# Altium schematic sheet 1-Controller.SchDoc
size A4
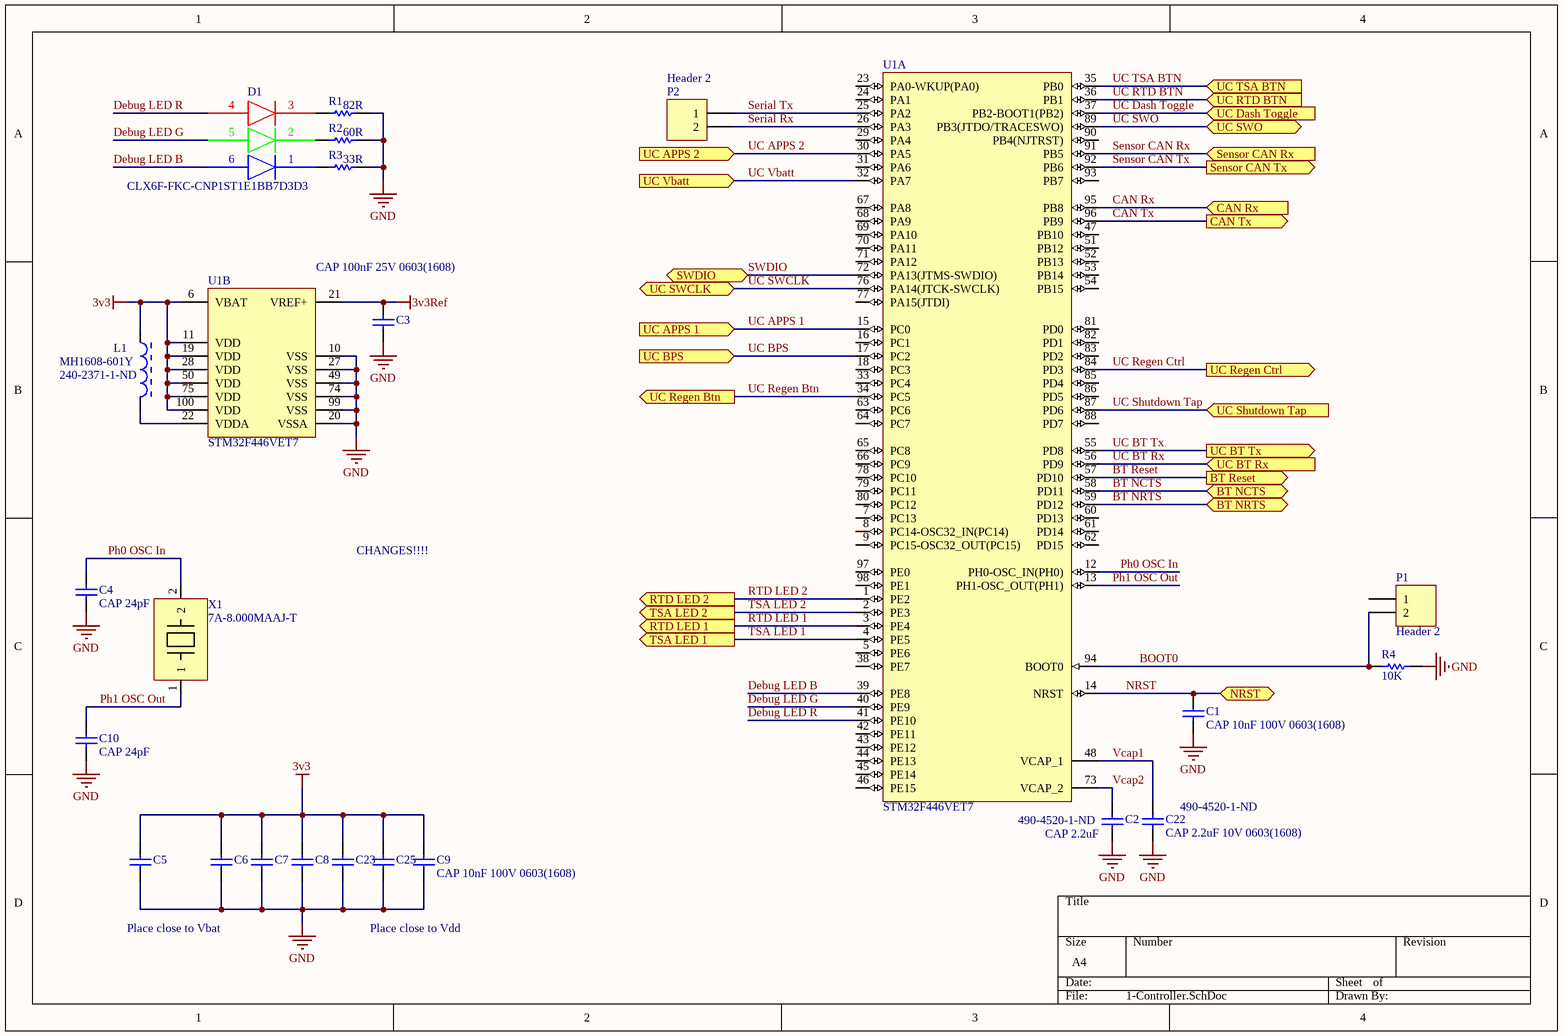
[diagram p0: 1-Controller.SchDoc]

## Parts
C1  CAP 10nF 100V 0603(1608)  [CAPC0603(1608)100_M]
C2  CAP 2.2uF  Supplier Part Number 1: 490-4520-1-ND  [CAPC0603(1608)55_N]
C3  CAP 100nF 25V 0603(1608)  [CAPC0603(1608)100_N]
C4  CAP 24pF  [CAPC0603(1608)100_N]
C5  CAP 10nF 100V 0603(1608)  [CAPC0603(1608)100_M]  (value not drawn)
C6  CAP 10nF 100V 0603(1608)  [CAPC0603(1608)100_M]  (value not drawn)
C7  CAP 10nF 100V 0603(1608)  [CAPC0603(1608)100_M]  (value not drawn)
C8  CAP 10nF 100V 0603(1608)  [CAPC0603(1608)100_M]  (value not drawn)
C9  CAP 10nF 100V 0603(1608)  [CAPC0603(1608)100_M]
C10  CAP 24pF  [CAPC0603(1608)100_N]
C22  CAP 2.2uF 10V 0603(1608)  Supplier Part Number 1: 490-4520-1-ND  [CAPC0603(1608)55_N]
C23  CAP 10nF 100V 0603(1608)  [CAPC0603(1608)100_M]  (value not drawn)
C25  CAP 10nF 100V 0603(1608)  [CAPC0603(1608)100_M]  (value not drawn)
D1  CLX6F-FKC-CNP1ST1E1BB7D3D3  [CLX6C-FKB]
L1  MH1608-601Y  Supplier Part Number 1: 240-2371-1-ND  [BOUR-MH1608_V]
P1  Header 2  [HDR1X2]
P2  Header 2  [HDR1X2]
R1  82R  [RESC0603(1608)_N]
R2  60R  [RESC0603(1608)_N]
R3  33R  [RESC0603(1608)_N]
R4  10K  [RESC0603(1608)_N]
U1  STM32F446VET7  [STM-LQFP100_L]  (parts A,B of 2)
X1  7A-8.000MAAJ-T  [2-SMD, No Lead]

## Ports
BT NCTS (bidir), BT NRTS (bidir), BT Reset (out), CAN Rx (in), CAN Tx (out), NRST (bidir), RTD LED 1 (out), RTD LED 2 (out), Sensor CAN Rx (in), Sensor CAN Tx (out), SWDIO (bidir), TSA LED 1 (out), TSA LED 2 (out), UC APPS 1 (in), UC APPS 2 (in), UC BPS (in), UC BT Rx (in), UC BT Tx (out), UC Dash Toggle (in), UC Regen Btn (out), UC Regen Ctrl (out), UC RTD BTN (in), UC Shutdown Tap (in), UC SWCLK (bidir), UC SWO (bidir), UC TSA BTN (in), UC Vbatt (in)

## Nets
3v3: C5.2 C6.2 C7.2 C8.2 C9.2 C23.2 C25.2 L1.1 U1.6(VBAT) U1.11(VDD) U1.19(VDD) U1.28(VDD) U1.50(VDD) U1.75(VDD) U1.100(VDD)
3v3Ref: C3.2 U1.21(VREF+)
GND: C1.1 C2.1 C3.1 C4.1 C5.1 C6.1 C7.1 C8.1 C9.1 C10.1 C22.1 C23.1 C25.1 R1.2 R2.2 R3.2 R4.2 U1.10(VSS) U1.20(VSSA) U1.27(VSS) U1.49(VSS) U1.74(VSS) U1.99(VSS)
BOOT0: P1.2 R4.1 U1.94(BOOT0)
BT NCTS: U1.58(PD11) ; port BT NCTS
BT NRTS: U1.59(PD12) ; port BT NRTS
BT Reset: U1.57(PD10) ; port BT Reset
CAN Rx: U1.95(PB8) ; port CAN Rx
CAN Tx: U1.96(PB9) ; port CAN Tx
Debug LED B: D1.6(B) U1.39(PE8)
Debug LED G: D1.5(G) U1.40(PE9)
Debug LED R: D1.4(R) U1.41(PE10)
NRST: C1.2 U1.14(NRST) ; port NRST
Ph0 OSC In: C4.2 U1.12(PH0-OSC_IN(PH0)) X1.2
Ph1 OSC Out: C10.2 U1.13(PH1-OSC_OUT(PH1)) X1.1
RTD LED 1: U1.3(PE4) ; port RTD LED 1
RTD LED 2: U1.1(PE2) ; port RTD LED 2
Sensor CAN Rx: U1.91(PB5) ; port Sensor CAN Rx
Sensor CAN Tx: U1.92(PB6) ; port Sensor CAN Tx
Serial Rx: P2.2 U1.26(PA3)
Serial Tx: P2.1 U1.25(PA2)
SWDIO: U1.72(PA13(JTMS-SWDIO)) ; port SWDIO
TSA LED 1: U1.4(PE5) ; port TSA LED 1
TSA LED 2: U1.2(PE3) ; port TSA LED 2
UC APPS 1: U1.15(PC0) ; port UC APPS 1
UC APPS 2: U1.30(PA5) ; port UC APPS 2
UC BPS: U1.17(PC2) ; port UC BPS
UC BT Rx: U1.56(PD9) ; port UC BT Rx
UC BT Tx: U1.55(PD8) ; port UC BT Tx
UC Dash Toggle: U1.37(PB2-BOOT1(PB2)) ; port UC Dash Toggle
UC Regen Btn: U1.34(PC5) ; port UC Regen Btn
UC Regen Ctrl: U1.84(PD3) ; port UC Regen Ctrl
UC RTD BTN: U1.36(PB1) ; port UC RTD BTN
UC Shutdown Tap: U1.87(PD6) ; port UC Shutdown Tap
UC SWCLK: U1.76(PA14(JTCK-SWCLK)) ; port UC SWCLK
UC SWO: U1.89(PB3(JTDO/TRACESWO)) ; port UC SWO
UC TSA BTN: U1.35(PB0) ; port UC TSA BTN
UC Vbatt: U1.32(PA7) ; port UC Vbatt
Vcap1: C22.2 U1.48(VCAP_1)
Vcap2: C2.2 U1.73(VCAP_2)
NetD1_1: D1.1(B) R3.1
NetD1_2: D1.2(G) R2.1
NetD1_3: D1.3(R) R1.1
NetL1_2: L1.2 U1.22(VDDA)

Not connected (* = marked no-connect by the designer): P1 1; U1 5(PE6) 7(PC13) 8(PC14-OSC32_IN(PC14)) 9(PC15-OSC32_OUT(PC15)) 16(PC1) 18(PC3) 23(PA0-WKUP(PA0)) 24(PA1) 29(PA4) 31(PA6) 33(PC4) 38(PE7) 42(PE11) 43(PE12) 44(PE13) 45(PE14) 46(PE15) 47(PB10) 51(PB12) 52(PB13) 53(PB14) 54(PB15) 60(PD13) 61(PD14) 62(PD15) 63(PC6) 64(PC7) 65(PC8) 66(PC9) 67(PA8) 68(PA9) 69(PA10) 70(PA11) 71(PA12) 77(PA15(JTDI)) 78(PC10) 79(PC11) 80(PC12) 81(PD0) 82(PD1) 83(PD2) 85(PD4) 86(PD5) 88(PD7) 90(PB4(NJTRST)) 93(PB7) 97(PE0) 98(PE1)

## Notes on the sheet
- CHANGES!!!!
- Place close to Vbat
- Place close to Vdd

## Library data of the parts
C1 C5-C9 C23 C25 = CMP-1035-02326-1: CAP 10nF 100V ±20% 0603 (1608 Metric) Thickness 1mm SMD; Case-EIA: 0603; Tolerance: Â±20%; Case-Metric: 1608; Max Thickness: 1 mm; Technology: SMT; Value: 10nF; Rated Voltage: 100 V
C2 C22 = CMP-1035-02757-1: CAP 2.2uF 10V ±10% 0603 (1608 Metric) Thickness 0.55mm SMD; Case-EIA: 0603; Case-Metric: 1608; Tolerance: Â±10%; Value: 2.2uF; Rated Voltage: 10 V; Technology: SMT; Max Thickness: 0.55 mm; Supplier 1: Digi-Key
C3 = CMP-1035-02589-1: CAP 100nF 25V ±20% 0603 (1608 Metric) Thickness 1mm SMD; Case-EIA: 0603; Tolerance: Â±20%; Case-Metric: 1608; Value: 100nF; Max Thickness: 1 mm; Technology: SMT; Rated Voltage: 25 V
C4 C10 = CMP-1035-00843-1: CAP 24pF 16V ±2% 0603 (1608 Metric) Thickness 1mm SMD; Tolerance: Â±2%; Case-Metric: 1608; Case-EIA: 0603; Value: 24pF; Technology: SMT; Rated Voltage: 16 V; Max Thickness: 1 mm
D1 = LED - CLX6F-FKC-CNP1ST1E1BB7D3D3: Red, Green, Blue (RGB) 622nm Red, 530nm Green, 470nm Blue LED Indication - Discrete 2.1V Red, 2.7V Green, 3V Blue 6-SMD, J-Lead; ComponentLink1Description: Digikey; ComponentLink1URL: https://www.digikey.ca/product-detail/en/cree-inc/CLX6F-FKC-CNP1ST1E1BB7D3D3/CLX6F-FKC-CNP1ST1E1BB7D3D3CT-ND/6362814
L1 = CMP-2000-06698-1: Chip Bead, 600 Ohm, 1 A, -55 to 125 degC, 2-Pin SMD (0603), RoHS, Tape and Reel; Manufacturer: Bourns; Impedance @ Frequency: 600Ohm@100MHz; Online Catalog: MHSeries; DC Resistance (DCR) (Max): 200mOhm; Current Rating (Max): 1A; Other Names: MH1608-601YCT; EDA / CAD Models: DownloadfromAcceleratedDesigns; Filter Type: Power,SignalLine; Number of Lines: 1; Mounting Type: SurfaceMount; Manufacturer URL: http://www.bourns.com/; Package Description: 2-Pin Surface Mount Device, Body 1.6 x 0.8 mm; Category: Filters; Packaging: CutTape(CT); Family: FerriteBeadsandChips; Datasheet Version: 03/2015; Standard Package: 1; Mounting Technology: SurfaceMount; Package / Case: 0603(1608Metric); Datasheet URL: http://www.bourns.com/docs/Product-Datasheets/mh.pdf; Operating Temperature: -55°C~125°C; RoHS Information: MH1608SeriesMaterialDeclaration; Ratings: -; Package Reference: 0603; Series: MH; Supplier 1: Digi-Key
P1 P2 = Header 2: Header, 2-Pin; LatestRevisionDate: 17-Jul-2002; LatestRevisionNote: Re-released for DXP Platform.; Publisher: Altium Limited
R1 = CMP-1012-00048-1: 82R 0.1W 5% 0603 (1608 Metric)  SMD; Case-Metric: 1608; Value: 82.00 Ohm; Case-EIA: 0603; Technology: SMT; Tolerance: 5 %; Power: 0.1 W
R2 = CMP-1012-00372-1: 60R4 0.1W 1% 0603 (1608 Metric)  SMD; Case-EIA: 0603; Value: 60.40 Ohm; Case-Metric: 1608; Technology: SMT; Tolerance: 1 %; Power: 0.1 W
R3 = CMP-1012-00038-1: 33R 0.1W 5% 0603 (1608 Metric)  SMD; Value: 33.00 Ohm; Case-EIA: 0603; Case-Metric: 1608; Tolerance: 5 %; Technology: SMT; Power: 0.1 W
R4 = CMP-1012-00098-1: 10K 0.1W 5% 0603 (1608 Metric)  SMD; Case-EIA: 0603; Value: 10000.00 Ohm; Case-Metric: 1608; Technology: SMT; Tolerance: 5 %; Power: 0.1 W
U1 = CMP-0243-00221-1: ARM Cortex-M4 32-bit MCU+FPU, 512 KB Flash, 128 KB Internal RAM, 81 I/Os, 100-Pin LQFP, -40 to 105 degC, Tray; Supply Voltage(Vcc) min (V): 1.7; Operating Frequency(F) (Processor speed) (MHz): 180; D/A Converter: 2; FLASH Size (Prog) (kB): 512; I/Os (High Current): 81; Internal RAM Size (kB): 128; Core: ARM Cortex-M4; Packing: Tray; ComponentLink1URL: http://www.st.com/; DatasheetVersion: Rev. 6; Mounting Technology: Surface Mount; ComponentLink2Description: Datasheet; ComponentLink2URL: http://www.st.com/st-web-ui/static/active/en/resource/technical/document/datasheet/DM00141306.pdf; Package Reference: 100-Pin Low Profile Quad Flat Package, Body 14 x 14 mm, Pitch 0.5 mm; ComponentLink1Description: Manufacturer URL; Package Description: LQFP100; PartId: 1
X1 = 8MHz crystal, 7A-8.000MAAJ-T: Manufacturer: TXC CORPORATION; Frequency: 8MHz; Frequency Stability: ±30ppm; Load Capacitance: 18pF; ESR (Equivalent Series Resistance): 80 Ohm; Operating Mode: Fundamental; Supplier 1: Digi-Key; Manufacturer Part Number: 7A-8.000MAAJ-T; RoHS: RoHS Compliant; Category: Crystals, Oscillators, Resonators; Stock 1: 30692; Pricing 1: 1=1.12, 10=0.989, 50=0.9234, 100=0.8162, 500=0.77322 (CAD); Packaging: Cut Tape (CT); Part Status: Active; Type: MHz Crystal; Frequency Tolerance: ±30ppm; Operating Temperature: -20°C ~ 70°C; Ratings: -; Mounting Type: Surface Mount; Package / Case: 2-SMD, No Lead; Size / Dimension: 0.197" L x 0.126" W (5.00mm x 3.20mm); Height - Seated (Max): 0.053" (1.35mm); ComponentLink1URL: http://www.txccrystal.com/images/pdf/7a.pdf; ComponentLink1Description: http://www.txccrystal.com/images/pdf/7a.pdf; Supplier Part Number 1: 887-1448-1-ND